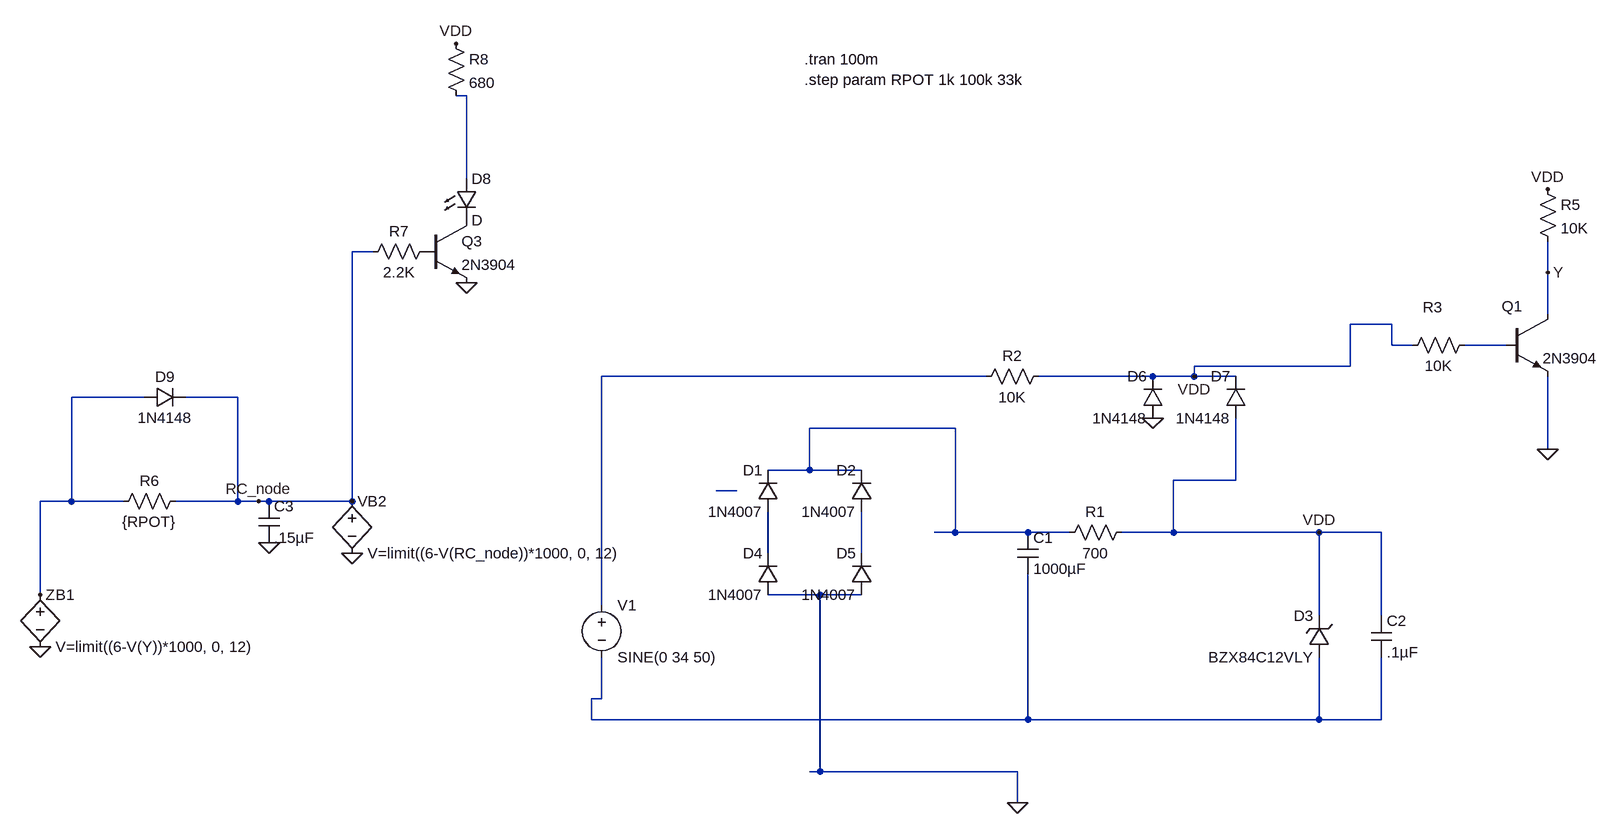
[diagram p0: schematic Draft1.asc]
Draft1.asc, the LTspice schematic file:
Version 4.1
SHEET 1 1976 680
WIRE -160 -768 -176 -768
WIRE -160 -640 -160 -768
WIRE -304 -528 -336 -528
WIRE 1504 -496 1504 -544
WIRE 1504 -432 1504 -496
WIRE 1264 -416 1200 -416
WIRE 1264 -384 1264 -416
WIRE 1296 -384 1264 -384
WIRE 1440 -384 1376 -384
WIRE 1200 -352 1200 -416
WIRE 1200 -352 960 -352
WIRE 640 -336 48 -336
WIRE 896 -336 720 -336
WIRE 960 -336 960 -352
WIRE 960 -336 896 -336
WIRE 1024 -336 960 -336
WIRE -656 -304 -768 -304
WIRE -512 -304 -592 -304
WIRE 592 -256 368 -256
WIRE 1504 -224 1504 -336
WIRE 368 -192 368 -256
WIRE 368 -192 304 -192
WIRE 448 -192 368 -192
WIRE 1024 -176 1024 -272
WIRE 1024 -176 928 -176
WIRE 256 -160 224 -160
WIRE -768 -144 -768 -304
WIRE -768 -144 -816 -144
WIRE -688 -144 -768 -144
WIRE -512 -144 -512 -304
WIRE -512 -144 -608 -144
WIRE -480 -144 -512 -144
WIRE -464 -144 -480 -144
WIRE -336 -144 -336 -528
WIRE -336 -144 -464 -144
WIRE 592 -96 592 -256
WIRE 592 -96 560 -96
WIRE 704 -96 592 -96
WIRE 768 -96 704 -96
WIRE 928 -96 928 -176
WIRE 928 -96 848 -96
WIRE 1152 -96 928 -96
WIRE 1248 -96 1152 -96
WIRE 304 -64 304 -128
WIRE 448 -64 448 -128
WIRE -816 0 -816 -144
WIRE 384 0 304 0
WIRE 448 0 384 0
WIRE 48 16 48 -336
WIRE 1152 32 1152 -96
WIRE 1248 32 1248 -96
WIRE 48 160 48 96
WIRE 48 160 32 160
WIRE 32 192 32 160
WIRE 704 192 704 -32
WIRE 704 192 32 192
WIRE 1152 192 1152 96
WIRE 1152 192 704 192
WIRE 1248 192 1248 96
WIRE 1248 192 1152 192
WIRE 384 272 384 0
WIRE 384 272 368 272
WIRE 688 272 384 272
WIRE 688 320 688 272
FLAG 1152 -96 VDD
FLAG 896 -272 0
FLAG 1504 -224 0
FLAG 1504 -624 VDD
FLAG 1504 -496 Y
FLAG -816 80 0
FLAG -816 0 Z
FLAG -464 -80 0
FLAG -336 -64 0
FLAG -336 -144 V
FLAG -160 -480 0
FLAG -176 -848 VDD
FLAG 960 -336 VDD
FLAG -480 -144 RC_node
FLAG 688 320 0
SYMBOL voltage 48 0 R0
WINDOW 123 0 0 Left 0
WINDOW 39 0 0 Left 0
SYMATTR InstName V1
SYMATTR Value SINE(0 34 50)
SYMBOL diode 320 -128 R180
WINDOW 0 24 64 Left 2
WINDOW 3 24 0 Left 2
SYMATTR InstName D1
SYMATTR Value 1N4007
SYMBOL diode 320 0 R180
WINDOW 0 24 64 Left 2
WINDOW 3 24 0 Left 2
SYMATTR InstName D4
SYMATTR Value 1N4007
SYMBOL diode 464 0 R180
WINDOW 0 24 64 Left 2
WINDOW 3 24 0 Left 2
SYMATTR InstName D5
SYMATTR Value 1N4007
SYMBOL diode 464 -128 R180
WINDOW 0 24 64 Left 2
WINDOW 3 24 0 Left 2
SYMATTR InstName D2
SYMATTR Value 1N4007
SYMBOL res 864 -112 R90
WINDOW 0 0 56 VBottom 2
WINDOW 3 32 56 VTop 2
SYMATTR InstName R1
SYMATTR Value 700
SYMBOL zener 1168 96 R180
WINDOW 0 24 64 Left 2
WINDOW 3 24 0 Left 2
SYMATTR InstName D3
SYMATTR Value BZX84C12VLY
SYMATTR Description Diode
SYMATTR Type diode
SYMBOL cap 1232 32 R0
SYMATTR InstName C2
SYMATTR Value .1µF
SYMBOL cap 688 -96 R0
SYMATTR InstName C1
SYMATTR Value 1000µF
SYMBOL res 736 -352 R90
WINDOW 0 0 56 VBottom 2
WINDOW 3 32 56 VTop 2
SYMATTR InstName R2
SYMATTR Value 10K
SYMBOL diode 912 -272 R180
WINDOW 0 24 64 Left 2
WINDOW 3 24 0 Left 2
SYMATTR InstName D6
SYMATTR Value 1N4148
SYMBOL diode 1040 -272 R180
WINDOW 0 24 64 Left 2
WINDOW 3 24 0 Left 2
SYMATTR InstName D7
SYMATTR Value 1N4148
SYMBOL res 1392 -400 R90
WINDOW 0 -27 65 VBottom 2
WINDOW 3 32 56 VTop 2
SYMATTR InstName R3
SYMATTR Value 10K
SYMBOL npn 1440 -432 R0
WINDOW 0 -7 -12 Left 2
SYMATTR InstName Q1
SYMATTR Value 2N3904
SYMBOL res 1488 -640 R0
SYMATTR InstName R5
SYMATTR Value 10K
SYMBOL bv -816 -16 R0
SYMATTR InstName B1
SYMATTR Value V=limit((6-V(Y))*1000, 0, 12)
SYMBOL res -704 -128 R270
WINDOW 0 32 56 VTop 2
WINDOW 3 0 56 VBottom 2
SYMATTR InstName R6
SYMATTR Value {RPOT}
SYMBOL cap -480 -144 R0
SYMATTR InstName C3
SYMATTR Value .15µF
SYMBOL bv -336 -160 R0
SYMATTR InstName B2
SYMATTR Value V=limit((6-V(RC_node))*1000, 0, 12)
SYMBOL res -208 -544 R90
WINDOW 0 0 56 VBottom 2
WINDOW 3 32 56 VTop 2
SYMATTR InstName R7
SYMATTR Value 2.2K
SYMBOL npn -224 -576 R0
SYMATTR InstName Q3
SYMATTR Value 2N3904
SYMBOL LED -176 -640 R0
SYMATTR InstName D8
SYMBOL res -192 -864 R0
SYMATTR InstName R8
SYMATTR Value 680
SYMBOL diode -656 -288 R270
WINDOW 0 32 32 VTop 2
WINDOW 3 0 32 VBottom 2
SYMATTR InstName D9
SYMATTR Value 1N4148
TEXT 360 -824 Left 2 !.tran 100m\n.step param RPOT 1k 100k 33k

The netlist it stands for:
* Draft1.asc
V1 N003 N008 SINE(0 34 50)
D1 N006 N004 1N4007
D4 0 N006 1N4007
D5 0 N007 1N4007
D2 N007 N004 1N4007
R1 VDD N004 700
D3 N008 VDD BZX84C12VLY
C2 VDD N008 .1µF
C1 N004 N008 1000µF
R2 VDD N003 10K
D6 0 VDD 1N4148
D7 VDD VDD 1N4148
R3 N002 VDD 10K
Q1 Y N002 0 0 2N3904
R5 VDD Y 10K
B1 Z 0 V=limit((6-V(Y))*1000, 0, 12)
R6 Z RC_node {RPOT}
C3 RC_node 0 .15µF
B2 RC_node 0 V=limit((6-V(RC_node))*1000, 0, 12)
R7 P001 RC_node 2.2K
Q3 P002 P001 0 0 2N3904
D8 N001 P002 D
R8 VDD N001 680
D9 Z RC_node 1N4148
.model D D
.lib standard.dio
.model NPN NPN
.model PNP PNP
.lib standard.bjt
.tran 100m
.step param RPOT 1k 100k 33k
.backanno
.end